# EAGLE design RingBoard (EAGLE 6.2)
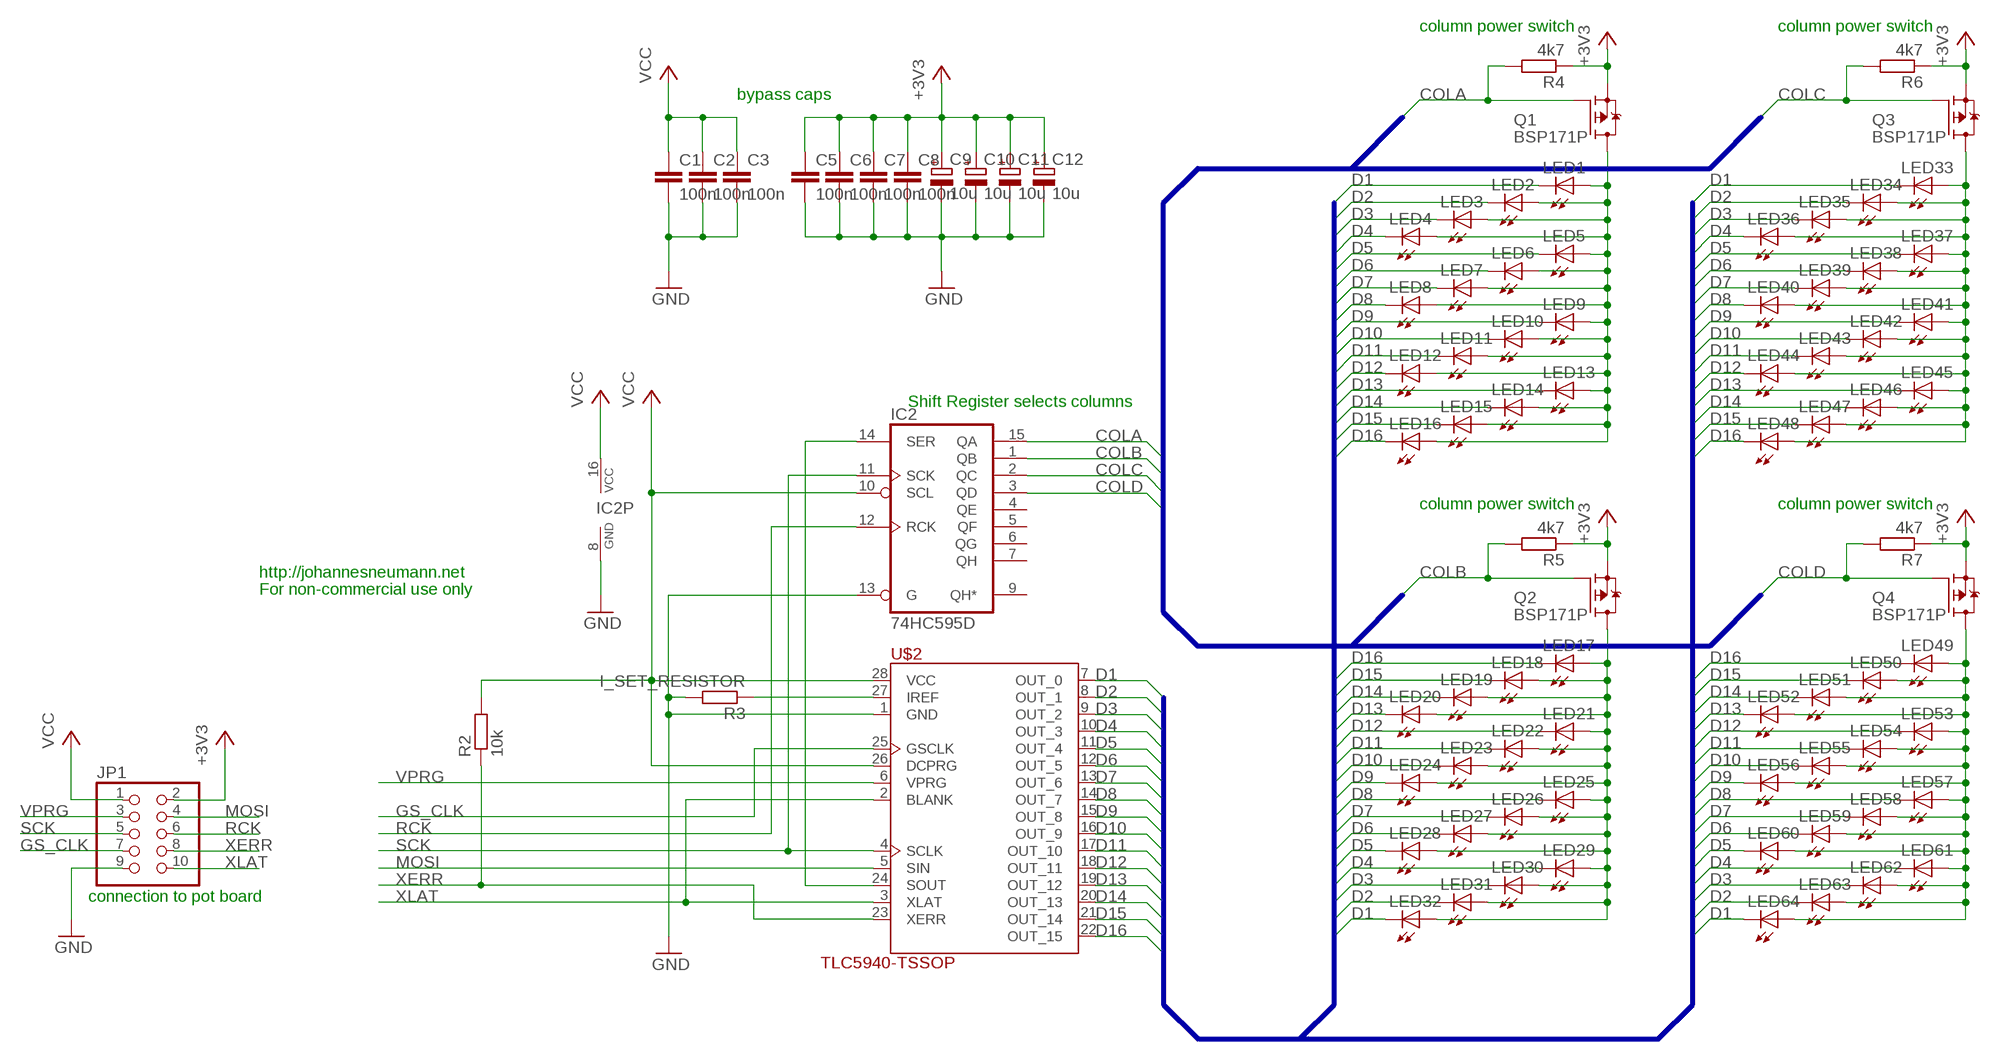
[diagram p0: schematic, sheet 1]

## Parts
C1  100n  C-EUC0603  [C0603]
C2  100n  C-EUC0603  [C0603]
C3  100n  C-EUC0603  [C0603]
C5  100n  C-EUC0603  [C0603]
C6  100n  C-EUC0603  [C0603]
C7  100n  C-EUC0603  [C0603]
C8  100n  C-EUC0603  [C0603]
C9  10u  CPOL-EU153CLV-0605  [153CLV-0605]
C10  10u  CPOL-EU153CLV-0605  [153CLV-0605]
C11  10u  CPOL-EU153CLV-0605  [153CLV-0605]
C12  10u  CPOL-EU153CLV-0605  [153CLV-0605]
IC2  74HC595D  [SO16]
JP1  PINHD-2X5_2.54-SMD  [2X05SMD]
LED1  LEDCHIP-LED0805  [CHIP-LED0805]
LED2  LEDCHIP-LED0805  [CHIP-LED0805]
LED3  LEDCHIP-LED0805  [CHIP-LED0805]
LED4  LEDCHIP-LED0805  [CHIP-LED0805]
LED5  LEDCHIP-LED0805  [CHIP-LED0805]
LED6  LEDCHIP-LED0805  [CHIP-LED0805]
LED7  LEDCHIP-LED0805  [CHIP-LED0805]
LED8  LEDCHIP-LED0805  [CHIP-LED0805]
LED9  LEDCHIP-LED0805  [CHIP-LED0805]
LED10  LEDCHIP-LED0805  [CHIP-LED0805]
LED11  LEDCHIP-LED0805  [CHIP-LED0805]
LED12  LEDCHIP-LED0805  [CHIP-LED0805]
LED13  LEDCHIP-LED0805  [CHIP-LED0805]
LED14  LEDCHIP-LED0805  [CHIP-LED0805]
LED15  LEDCHIP-LED0805  [CHIP-LED0805]
LED16  LEDCHIP-LED0805  [CHIP-LED0805]
LED17  LEDCHIP-LED0805  [CHIP-LED0805]
LED18  LEDCHIP-LED0805  [CHIP-LED0805]
LED19  LEDCHIP-LED0805  [CHIP-LED0805]
LED20  LEDCHIP-LED0805  [CHIP-LED0805]
LED21  LEDCHIP-LED0805  [CHIP-LED0805]
LED22  LEDCHIP-LED0805  [CHIP-LED0805]
LED23  LEDCHIP-LED0805  [CHIP-LED0805]
LED24  LEDCHIP-LED0805  [CHIP-LED0805]
LED25  LEDCHIP-LED0805  [CHIP-LED0805]
LED26  LEDCHIP-LED0805  [CHIP-LED0805]
LED27  LEDCHIP-LED0805  [CHIP-LED0805]
LED28  LEDCHIP-LED0805  [CHIP-LED0805]
LED29  LEDCHIP-LED0805  [CHIP-LED0805]
LED30  LEDCHIP-LED0805  [CHIP-LED0805]
LED31  LEDCHIP-LED0805  [CHIP-LED0805]
LED32  LEDCHIP-LED0805  [CHIP-LED0805]
LED33  LEDCHIP-LED0805  [CHIP-LED0805]
LED34  LEDCHIP-LED0805  [CHIP-LED0805]
LED35  LEDCHIP-LED0805  [CHIP-LED0805]
LED36  LEDCHIP-LED0805  [CHIP-LED0805]
LED37  LEDCHIP-LED0805  [CHIP-LED0805]
LED38  LEDCHIP-LED0805  [CHIP-LED0805]
LED39  LEDCHIP-LED0805  [CHIP-LED0805]
LED40  LEDCHIP-LED0805  [CHIP-LED0805]
LED41  LEDCHIP-LED0805  [CHIP-LED0805]
LED42  LEDCHIP-LED0805  [CHIP-LED0805]
LED43  LEDCHIP-LED0805  [CHIP-LED0805]
LED44  LEDCHIP-LED0805  [CHIP-LED0805]
LED45  LEDCHIP-LED0805  [CHIP-LED0805]
LED46  LEDCHIP-LED0805  [CHIP-LED0805]
LED47  LEDCHIP-LED0805  [CHIP-LED0805]
LED48  LEDCHIP-LED0805  [CHIP-LED0805]
LED49  LEDCHIP-LED0805  [CHIP-LED0805]
LED50  LEDCHIP-LED0805  [CHIP-LED0805]
LED51  LEDCHIP-LED0805  [CHIP-LED0805]
LED52  LEDCHIP-LED0805  [CHIP-LED0805]
LED53  LEDCHIP-LED0805  [CHIP-LED0805]
LED54  LEDCHIP-LED0805  [CHIP-LED0805]
LED55  LEDCHIP-LED0805  [CHIP-LED0805]
LED56  LEDCHIP-LED0805  [CHIP-LED0805]
LED57  LEDCHIP-LED0805  [CHIP-LED0805]
LED58  LEDCHIP-LED0805  [CHIP-LED0805]
LED59  LEDCHIP-LED0805  [CHIP-LED0805]
LED60  LEDCHIP-LED0805  [CHIP-LED0805]
LED61  LEDCHIP-LED0805  [CHIP-LED0805]
LED62  LEDCHIP-LED0805  [CHIP-LED0805]
LED63  LEDCHIP-LED0805  [CHIP-LED0805]
LED64  LEDCHIP-LED0805  [CHIP-LED0805]
Q1  BSP171P  BSP170P  [SOT223]
Q2  BSP171P  BSP170P  [SOT223]
Q3  BSP171P  BSP170P  [SOT223]
Q4  BSP171P  BSP170P  [SOT223]
R2  10k  R-EU_R0603  [R0603]
R3  I_SET_RESISTOR  R-EU_M1406  [M1406]
R4  4k7  R-EU_R0603  [R0603]
R5  4k7  R-EU_R0603  [R0603]
R6  4k7  R-EU_R0603  [R0603]
R7  4k7  R-EU_R0603  [R0603]
U$2  TLC5940-TSSOP  [HTSSOP-28]

## Nets
+3V3: C5.1 C6.1 C7.1 C8.1 C9.+ C10.+ C11.+ C12.+ JP1.2 Q1.3(S) Q2.3(S) Q3.3(S) Q4.3(S) R4.1 R5.1 R6.1 R7.1
COLA: IC2.15(QA) Q1.1(G) R4.2
COLB: IC2.1(QB) Q2.1(G) R5.2
COLC: IC2.2(QC) Q3.1(G) R6.2
COLD: IC2.3(QD) Q4.1(G) R7.2
D1: LED1.C LED32.C LED33.C LED64.C U$2.7(OUT_0)
D2: LED2.C LED31.C LED34.C LED63.C U$2.8(OUT_1)
D3: LED3.C LED30.C LED35.C LED62.C U$2.9(OUT_2)
D4: LED4.C LED29.C LED36.C LED61.C U$2.10(OUT_3)
D5: LED5.C LED28.C LED37.C LED60.C U$2.11(OUT_4)
D6: LED6.C LED27.C LED38.C LED59.C U$2.12(OUT_5)
D7: LED7.C LED26.C LED39.C LED58.C U$2.13(OUT_6)
D8: LED8.C LED25.C LED40.C LED57.C U$2.14(OUT_7)
D9: LED9.C LED24.C LED41.C LED56.C U$2.15(OUT_8)
D10: LED10.C LED23.C LED42.C LED55.C U$2.16(OUT_9)
D11: LED11.C LED22.C LED43.C LED54.C U$2.17(OUT_10)
D12: LED12.C LED21.C LED44.C LED53.C U$2.18(OUT_11)
D13: LED13.C LED20.C LED45.C LED52.C U$2.19(OUT_12)
D14: LED14.C LED19.C LED46.C LED51.C U$2.20(OUT_13)
D15: LED15.C LED18.C LED47.C LED50.C U$2.21(OUT_14)
D16: LED16.C LED17.C LED48.C LED49.C U$2.22(OUT_15)
GND: C1.2 C2.2 C3.2 C5.2 C6.2 C7.2 C8.2 C9.- C10.- C11.- C12.- IC2.8(GND) IC2.13(G) JP1.9 R3.2 U$2.1(GND)
GS_CLK: JP1.7 U$2.25(GSCLK)
MOSI: JP1.4 U$2.5(SIN)
N$2: IC2.14(SER) U$2.24(SOUT)
N$4: LED17.A LED18.A LED19.A LED20.A LED21.A LED22.A LED23.A LED24.A LED25.A LED26.A LED27.A LED28.A LED29.A LED30.A LED31.A LED32.A Q2.2(D) Q2.4(D)
N$6: LED33.A LED34.A LED35.A LED36.A LED37.A LED38.A LED39.A LED40.A LED41.A LED42.A LED43.A LED44.A LED45.A LED46.A LED47.A LED48.A Q3.2(D) Q3.4(D)
N$8: LED49.A LED50.A LED51.A LED52.A LED53.A LED54.A LED55.A LED56.A LED57.A LED58.A LED59.A LED60.A LED61.A LED62.A LED63.A LED64.A Q4.2(D) Q4.4(D)
N$29: LED1.A LED2.A LED3.A LED4.A LED5.A LED6.A LED7.A LED8.A LED9.A LED10.A LED11.A LED12.A LED13.A LED14.A LED15.A LED16.A Q1.2(D) Q1.4(D)
N$41: R3.1 U$2.27(IREF)
RCK: IC2.12(RCK) JP1.6
SCK: IC2.11(SCK) JP1.5 U$2.4(SCLK)
VCC: C1.1 C2.1 C3.1 IC2.10(SCL) IC2.16(VCC) JP1.1 R2.2 U$2.26(DCPRG) U$2.28(VCC)
VPRG: JP1.3 U$2.6(VPRG)
XERR: JP1.8 R2.1 U$2.23(XERR)
XLAT: JP1.10 U$2.2(BLANK) U$2.3(XLAT)
Unconnected: IC2.4(QE) IC2.5(QF) IC2.6(QG) IC2.7(QH) IC2.9(QH*)

## Buses
B$1
B$2

## Notes on the sheet
- column power switch | column power switch
- bypass caps
- Shift Register selects columns
- column power switch | column power switch
- http://johannesneumann.net
- For non-commercial use only
- connection to pot board

## Library data of the parts
C1-C3 C5-C8 = rcl:C-EU: CAPACITOR, European symbol
C9-C12 = rcl:CPOL-EU: POLARIZED CAPACITOR, European symbol
IC2 = 74xx-eu:74*595: 8-bit SHIFT REGISTER, output latch
JP1 = pinhead-2:PINHD-2X5: PIN HEADER
LED1-LED64 = led:LED: LED OSRAM: - CHIPLED LG R971, LG N971, LY N971, LG Q971, LY Q971, LO R971, LY R971 LH N974, LH R974 LS Q976, LO Q976, LY Q976 LO Q996 - Hyper CHIPLED LW Q18S LB Q993, LB Q99A, LB R99A - SideLED LS A670, LO A670, LY A670, LG A670, LP A670 LB A673, LV A673, LT A673, LW A673 LH A674 LY A675 LS A676, LA A676, LO A676, LY A676, LW A676 LS A679, LY A679, LG A679 - Hyper Micro SIDELED® LS Y876, LA Y876, LO Y876, LY Y876 LT Y87S - SmartLED LW L88C, LW L88S LB L89C, LB L89S, LG L890 LS L89K, LO L89K, LY L89K LS L896, LA L896, LO L896, LY L896 - TOPLED LS T670, LO T670, LY T670, LG T670, LP T670 LSG T670, LSP T670, LSY T670, LOP T670, LYG T670 LG T671, LOG T671, LSG T671 LB T673, LV T673, LT T673, LW T673 LH T674 LS T676, LA T676, LO T676, LY T676, LB T676, LH T676, LSB T676, LW T676 LB T67C, LV T67C, LT T67C, LS T67K, LO T67K, LY T67K, LW E67C LS E67B, LA E67B, LO E67B, LY E67B, LB E67C, LV E67C, LT E67C LW T67C LS T679, LY T679, LG T679 LS T770, LO T770, LY T770, LG T770, LP T770 LB T773, LV T773, LT T773, LW T773 LH T774 LS E675, LA E675, LY E675, LS T675 LS T776, LA T776, LO T776, LY T776, LB T776 LHGB T686 LT T68C, LB T68C - Hyper Mini TOPLED® LB M676 - Mini TOPLED Santana® LG M470 LS M47K, LO M47K, LY M47K Source: http://www.osram.convergy.de LUXEON: - LUMILED® LXK2-PW12-R00, LXK2-PW12-S00, LXK2-PW14-U00, LXK2-PW14-V00 LXK2-PM12-R00, LXK2-PM12-S00, LXK2-PM14-U00 LXK2-PE12-Q00, LXK2-PE12-R00, LXK2-PE12-S00, LXK2-PE14-T00, LXK2-PE14-U00 LXK2-PB12-K00, LXK2-PB12-L00, LXK2-PB12-M00, LXK2-PB14-N00, LXK2-PB14-P00, LXK2-PB14-Q00 LXK2-PR12-L00, LXK2-PR12-M00, LXK2-PR14-Q00, LXK2-PR14-R00 LXK2-PD12-Q00, LXK2-PD12-R00, LXK2-PD12-S00 LXK2-PH12-R00, LXK2-PH12-S00 LXK2-PL12-P00, LXK2-PL12-Q00, LXK2-PL12-R00 Source: www.luxeon.com KINGBRIGHT: KA-3528ASYC Source: www.kingbright.com
Q1-Q4 = transistor-fet:BSP170P: SIPMOS(R) Small-Signal-Transistor P-Channel, Enhancement mode Source: http://www.infineon.com/upload/Document/BSP170P_Rev2.4.pdf
R2-R7 = rcl:R-EU_: RESISTOR, European symbol
U$2 = tlc5940:TLC5940-TSSOP

## Board
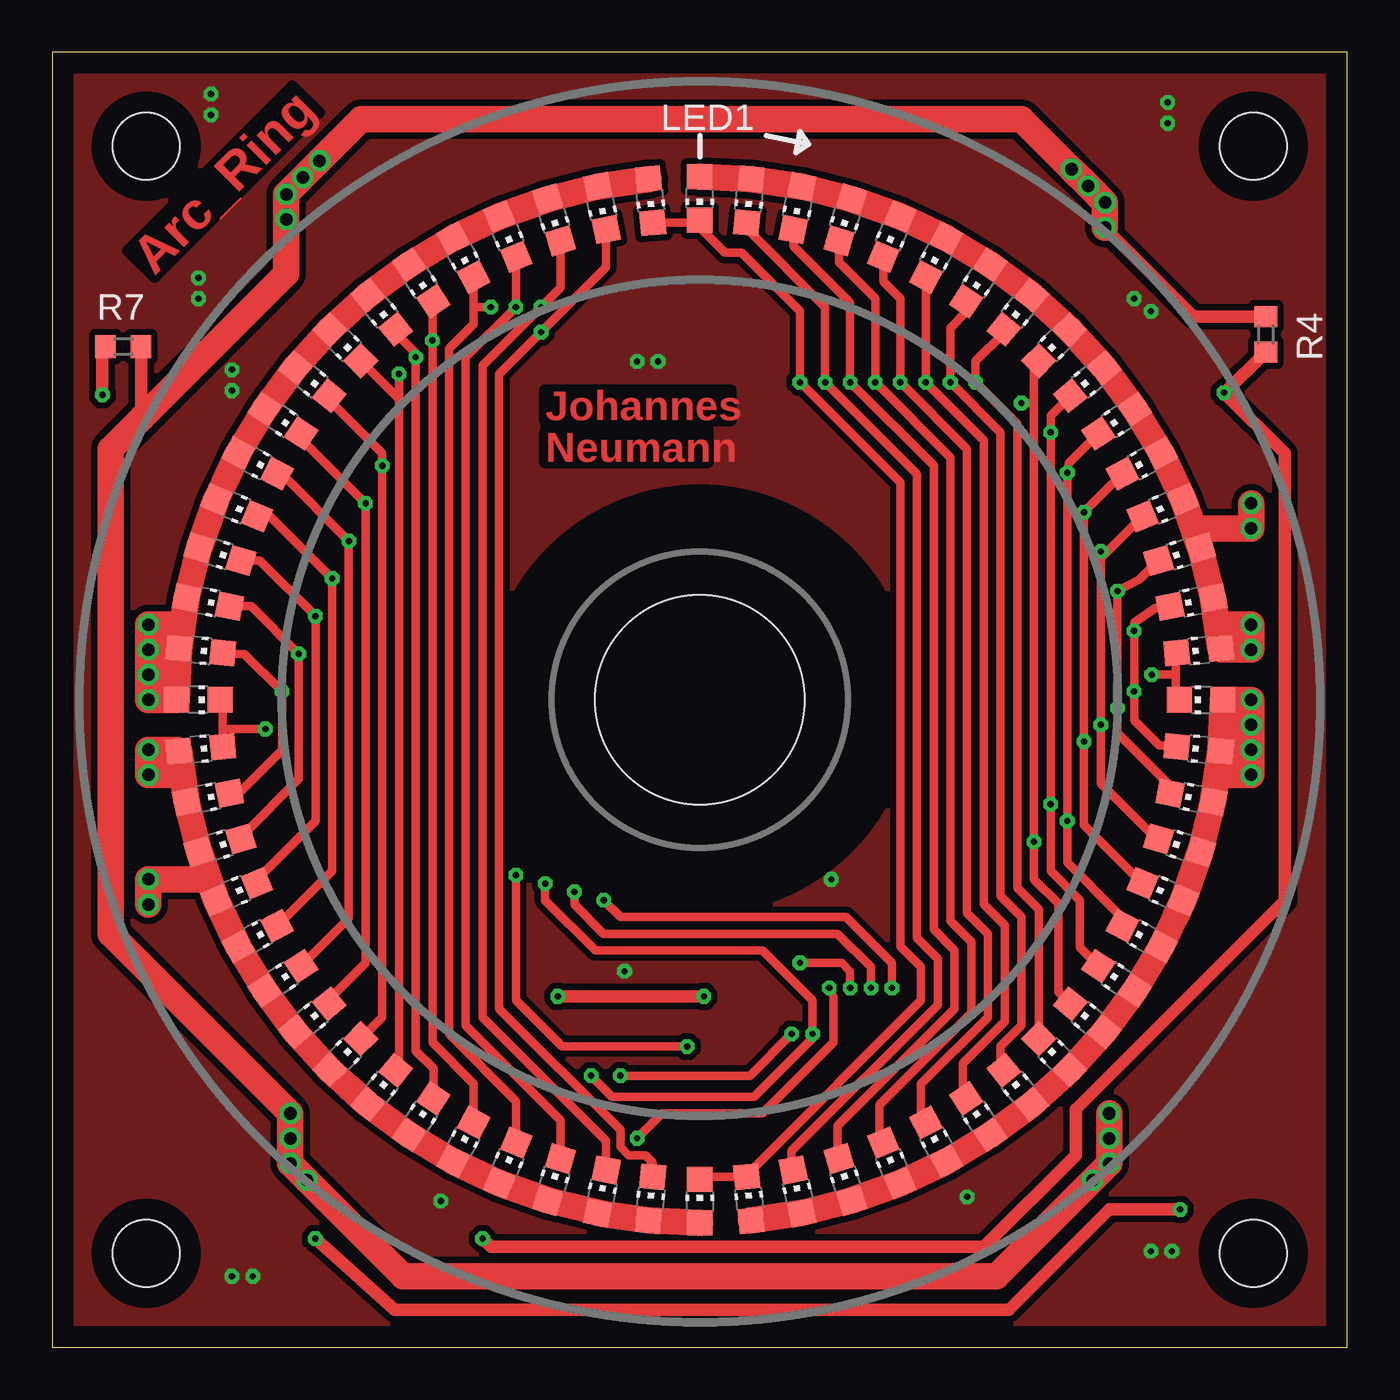
[diagram p1: board, top side]
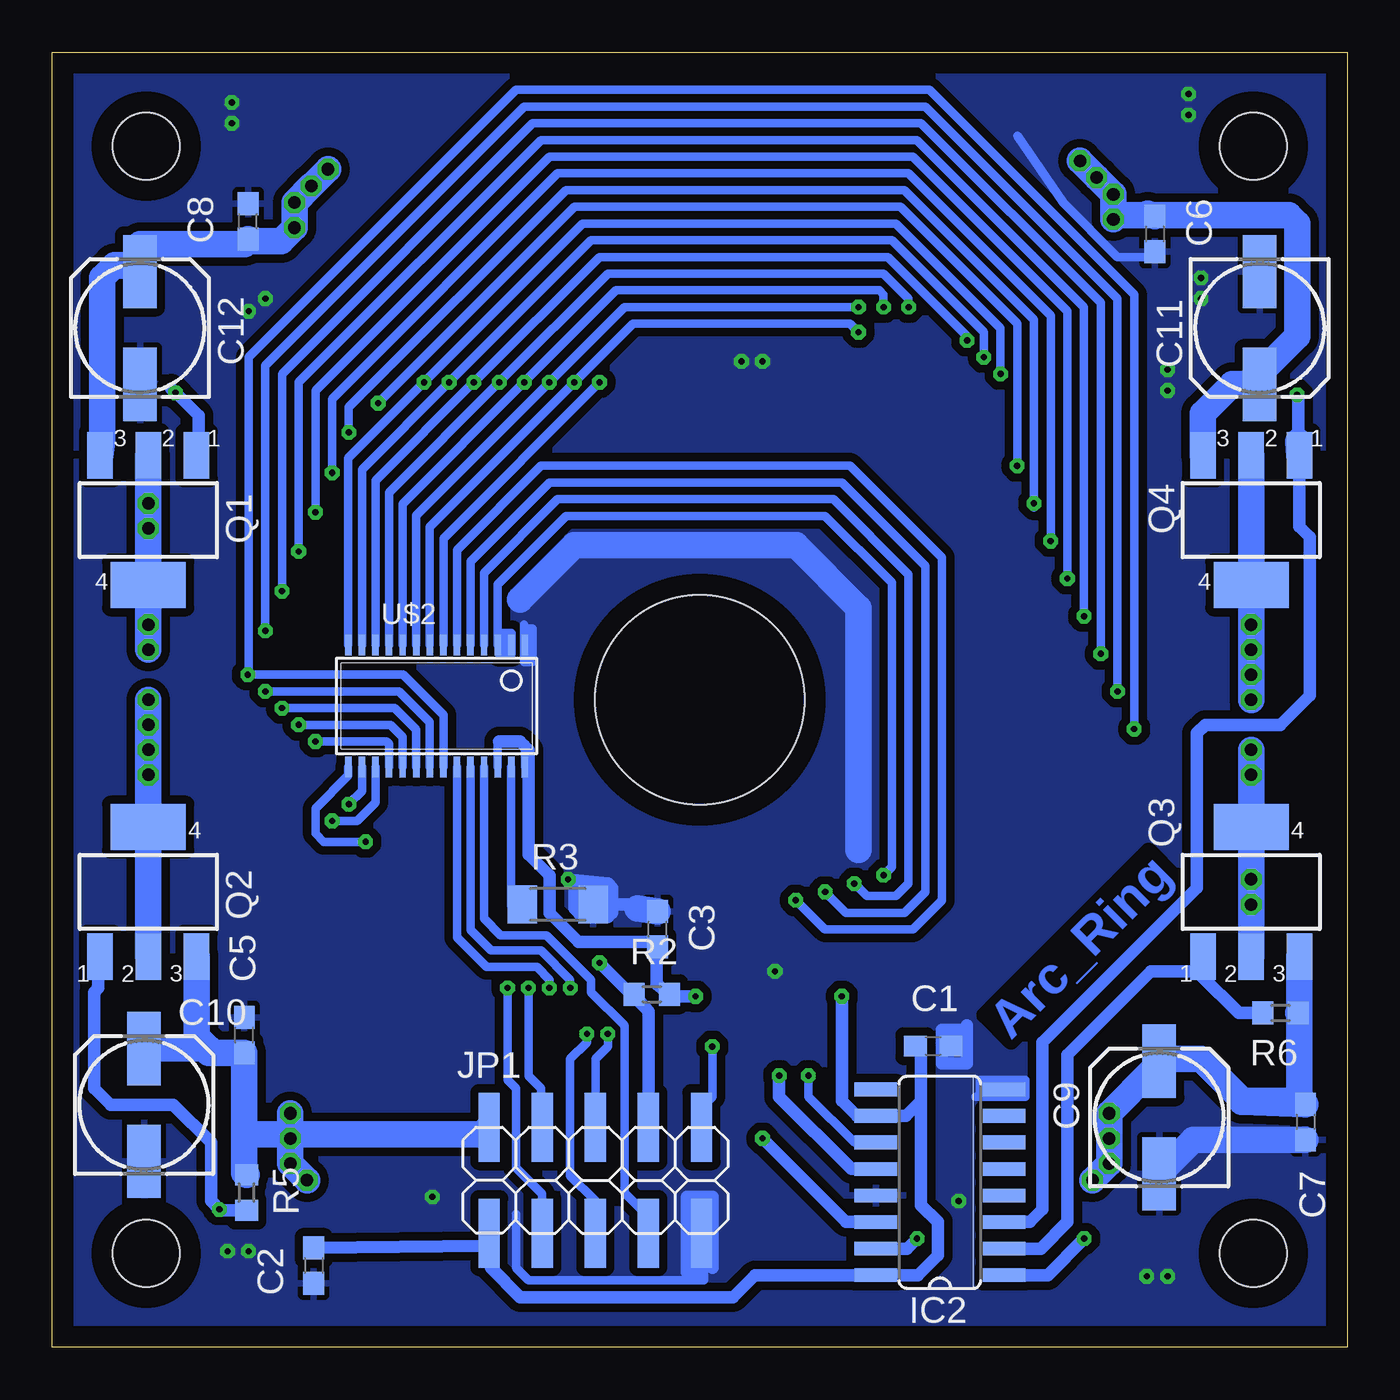
[diagram p2: board, bottom side, seen from below]

Size 62 x 62 mm. Coordinates in mm from the lower left corner, seen from the top.
Outline: 0,0 62,0 62,62 0,62 0,0
Copper layers (1*16): Top 0.035mm / dielectric 1.5mm / Bottom 0.035mm
Design rules "default": minimum track width 0.2mm, minimum drill 0.3mm, track to track 0.2mm, track to pad 0.2mm, pad to pad 0.2mm, via to via 0.2mm, smd to smd 0.15mm, copper to edge 40mil, drill to drill 8mil, minimum pad ring 0.2mm, minimum via ring 0.2mm, stop-mask expansion 0.15mm, vias tented up to drill 0.6mm, thermal gap 10mil
Holes 3.2 mm at 4.5,4.5 57.5,57.5 4.5,57.5 57.5,4.5
Holes 10 mm at 31,31
bKeepout: area 23.4,22.4 to 38.4,37.4
tRestrict: area 26,26 to 36,36

### Footprints (pad centres in the part's own frame; a part is rotated, then mirrored left to right if it is on the bottom)
C0603 = smd 1.1 x 1: 1 -0.85,0; 2 0.85,0
153CLV-0605 = smd 3.5 x 1.6: + 2.7,0; - -2.7,0
SO16 = smd 0.66 x 2.032: 1 -4.445,-3.073; 2 -3.175,-3.073; 3 -1.905,-3.073; 4 -0.635,-3.073; 5 0.635,-3.073; 6 1.905,-3.073; 7 3.175,-3.073; 8 4.445,-3.073; 9 4.445,3.073; 10 3.175,3.073; 11 1.905,3.073; 12 0.635,3.073; 13 -0.635,3.073; 14 -1.905,3.073; 15 -3.175,3.073; 16 -4.445,3.073
2X05SMD = smd 1.016 x 3.302: 1 -5.08,-2.54; 2 -5.08,2.54; 3 -2.54,-2.54; 4 -2.54,2.54; 5 0,-2.54; 6 0,2.54; 7 2.54,-2.54; 8 2.54,2.54; 9 5.08,-2.54; 10 5.08,2.54
CHIP-LED0805 = smd 1.2 x 1.2: A 0,-1.05; C 0,1.05
SOT223 = smd 1.219 x 2.235: 1 -2.311,-3.099; 2 0,-3.099; 3 2.311,-3.099 | smd 3.6 x 2.2: 4 0,3.099
R0603 = smd 1 x 1.1: 1 -0.85,0; 2 0.85,0
M1406 = smd 1.4 x 1.8: 1 -1.7,0; 2 1.7,0
HTSSOP-28 = smd 0.305 x 0.991: 1 -4.225,-2.918; 2 -3.575,-2.918; 3 -2.925,-2.918; 4 -2.275,-2.918; 5 -1.625,-2.918; 6 -0.975,-2.918; 7 -0.325,-2.918; 8 0.325,-2.918; 9 0.975,-2.918; 10 1.625,-2.918; 11 2.275,-2.918; 12 2.925,-2.918; 13 3.575,-2.918; 14 4.225,-2.918; 15 4.225,2.918; 16 3.575,2.918; 17 2.925,2.918; 18 2.275,2.918; 19 1.625,2.918; 20 0.975,2.918; 21 0.325,2.918; 22 -0.325,2.918; 23 -0.975,2.918; 24 -1.625,2.918; 25 -2.275,2.918; 26 -2.925,2.918; 27 -3.575,2.918; 28 -4.225,2.918

### Placement (x,y rotation side)
C1  19.83,14.42 0 bottom
C2  49.48,3.91 270 bottom
C3  33.02,20.01 90 bottom
C5  52.8,14.95 90 bottom
C6  9.22,53.31 270 bottom
C7  2,10.79 270 bottom
C8  52.62,53.91 90 bottom
C9  9,11 90 bottom
C10  57.6,11.6 90 bottom
C11  4.2,48.8 270 bottom
C12  57.8,48.8 90 bottom
IC2  19.5,7.9 90 bottom
JP1  36,8 0 bottom
LED1  31,55 180 top
LED2  33.35,54.88 174.4 top
LED3  35.68,54.54 168.8 top
LED4  37.97,53.97 163.1 top
LED5  40.18,53.17 157.5 top
LED6  42.31,52.17 151.9 top
LED7  44.33,50.96 146.2 top
LED8  46.23,49.55 140.6 top
LED9  47.97,47.97 135 top
LED10  49.55,46.23 129.4 top
LED11  50.96,44.33 123.8 top
LED12  52.17,42.31 118.1 top
LED13  53.17,40.18 112.5 top
LED14  53.97,37.97 106.9 top
LED15  54.54,35.68 101.2 top
LED16  54.88,33.35 95.6 top
LED17  55,31 90 top
LED18  54.88,28.65 84.4 top
LED19  54.54,26.32 78.8 top
LED20  53.97,24.03 73.1 top
LED21  53.17,21.82 67.5 top
LED22  52.17,19.69 61.9 top
LED23  50.96,17.67 56.2 top
LED24  49.55,15.77 50.6 top
LED25  47.97,14.03 45 top
LED26  46.23,12.45 39.4 top
LED27  44.33,11.04 33.8 top
LED28  42.31,9.83 28.1 top
LED29  40.18,8.83 22.5 top
LED30  37.97,8.03 16.9 top
LED31  35.68,7.46 11.2 top
LED32  33.35,7.12 5.6 top
LED33  31,7 0 top
LED34  28.65,7.12 354.4 top
LED35  26.32,7.46 348.8 top
LED36  24.03,8.03 343.1 top
LED37  21.82,8.83 337.5 top
LED38  19.69,9.83 331.9 top
LED39  17.67,11.04 326.2 top
LED40  15.77,12.45 320.6 top
LED41  14.03,14.03 315 top
LED42  12.45,15.77 309.4 top
LED43  11.04,17.67 303.8 top
LED44  9.83,19.69 298.1 top
LED45  8.83,21.82 292.5 top
LED46  8.03,24.03 286.9 top
LED47  7.46,26.32 281.2 top
LED48  7.12,28.65 275.6 top
LED49  7,31 270 top
LED50  7.12,33.35 264.4 top
LED51  7.46,35.68 258.8 top
LED52  8.03,37.97 253.1 top
LED53  8.83,40.18 247.5 top
LED54  9.83,42.31 241.9 top
LED55  11.04,44.33 236.2 top
LED56  12.45,46.23 230.6 top
LED57  14.03,47.97 225 top
LED58  15.77,49.55 219.4 top
LED59  17.67,50.96 213.8 top
LED60  19.69,52.17 208.1 top
LED61  21.82,53.17 202.5 top
LED62  24.03,53.97 196.9 top
LED63  26.32,54.54 191.2 top
LED64  28.65,54.88 185.6 top
Q1  57.4,39.6 180 bottom
Q2  57.4,21.8 0 bottom
Q3  4.6,21.8 0 bottom
Q4  4.6,39.6 180 bottom
R2  33.3,16.9 0 bottom
R3  37.8,21.2 0 bottom
R4  58.1,48.5 270 top
R5  52.7,7.4 270 bottom
R6  3.2,16 180 bottom
R7  3.4,47.9 180 top
U$2  43.6,30.7 180 bottom

### Tracks (layer width: path | path; a pad name or v marks a point on that pad's centre or on a via)
+3V3  (via drill 0.6)
  Top 0.61: R4.1 54.65,49.35 v50.4,53.6 | R7.1 4.25,44.55 4.3,44.5
  Top 1.27: v50.6,11.2 v50.6,8.8 45.2,3.4 16.8,3.4 v12.2,8 v11.4,8.8 v11.4,11.2 2.8,19.8 2.8,43 4.3,44.5 11.2,51.4 v11.2,55.2 v12.8,56.8 14.8,58.8 46.4,58.8 v48.8,56.4 v49.6,55.6 v50.4,54.8 v50.4,53.6
  Bottom 0.406: C9.+ 9,13.6 9.3,13.3
  Bottom 0.813: JP1.2 41.08,10.28 | 41.08,10.28 41,10.2 | 41.08,10.28 41.2,10.4
  Bottom 1.27: 5.04,11.74 C7.1 2.29,12.03 Q3.3 | Q3.3 2.29,16.06 R6.1 | v50.4,54.8 v50.4,53.6 51.04,52.96 52.52,52.96 C8.1 | v11.2,55.2 11.2,55 | v50.4,54.8 v49.6,55.6 | v50.6,11.2 v50.6,10 | v50.6,10 v50.6,8.8 v49.8,8 | Q3.3 2.29,11.89 2.2,11.8 5,11.8 7,13.8 8.8,13.8 9.3,13.3 v11.4,11.2 v11.4,10 v11.4,8.8 v12.2,8 | v12,56 v12.8,56.8 v11.2,55.2 | v50.4,54.8 v48.8,56.4 | 52.7,52.88 C8.1 | C12.+ 57.9,51.7 59,51.8 | Q1.3 59.6,43.41 59.6,51.2 59,51.8 | 59,51.8 57.8,51.8 57.8,52.8 52.78,52.8 C8.1 | Q4.3 6.91,44.69 5.5,46.1 C11.+ 4.1,46.7 2.4,48.4 2.4,53.8 2.8,54.2 9.8,54.2 | v11.2,55.2 11.2,54.2 9.8,54.2 | C6.1 9.54,54.26 9.8,54.2 | v11.2,54 v11.2,55.2 | Q2.3 55.09,15.8 | 55.09,15.8 55.09,14.89 54.5,14.3 | 55.19,15.9 55.09,15.8 | 52.8,10.2 C5.1 54.5,14.1 54.5,14.3 | 52.8,10.2 50.8,10.2 | 50.8,10.2 v50.6,10 | C10.+ 54.5,14.3 | 52.8,10.2 52.8,8.35 R5.1 | 41.2,10.4 41.4,10.2 50.8,10.2
COLA  (via drill 0.3)
  Top 0.61: R4.2 56.1,45.65 v56.1,45.7 59,42.8 59,21.4 49,11.4 49,9.2 44.6,4.8 21,4.8 v20.6,5.2
  Bottom 0.61: Q1.1 55,43.39 55,44.6 v56.1,45.7 56.3,45.9 | v20.6,5.2 21.07,4.72 IC2.15
COLB  (via drill 0.3)
  Top 0.61: v12.6,5.2 16.4,1.8 45.8,1.8 50.6,6.6 v54,6.6
  Bottom 0.61: v12.6,5.2 14.35,3.46 IC2.1 | R5.2 53.95,6.55 v54,6.6 54.4,7 54.4,9.8 56.2,11.6 59.2,11.6 60,12.4 60,17 59.8,17.2 59.8,18.79 Q2.1
COLC
  Bottom 0.61: R6.2 5.2,16 7,17.8 7,18 | 7,18 7,18.61 Q3.1 | IC2.2 14.68,4.72 13.4,6 13.4,14 9.4,18 7,18
COLD  (via drill 0.3)
  Top 0.61: v2.4,45.6 2.4,47.75 R7.2
  Bottom 0.61: Q4.1 2.29,39.29 1.8,38.8 1.8,31.2 3.2,29.8 6.8,29.8 7.2,29.4 7.2,22 14.6,14.6 14.6,6.6 15.2,6 IC2.3 | 2.35,43.36 2.35,45.55 v2.4,45.6
  Bottom 1.27: 2.35,43.36 Q4.1
D1  (via drill 0.3)
  Top 0.406: LED33.C 31.11,8.16 LED32.C 33.6,8.51 33.6,8.6 41.6,16.6 41.6,18.2 40.6,19.2 40.6,41.4 v35.8,46.2 35.8,49.6 33,52.4 32.2,52.4 31,53.6 LED1.C 30.89,53.84 LED64.C
  Bottom 0.406: U$2.7 43.27,38.73 v35.8,46.2
D2  (via drill 0.3)
  Top 0.406: LED2.C 33.25,53.55 37,49.8 v37,46.2 41.4,41.8 41.4,19.6 42.4,18.6 42.4,16.4 35.4,9.4 35.4,8.57 LED31.C | LED63.C 26.52,51.72 v23.4,48.6 21.4,46.6 21.4,16.2 27.2,10.4 27.2,9.6 27.6,9.2 28.4,9.2 28.75,8.85 LED34.C | LED34.C
  Bottom 0.406: U$2.8 43.92,39.27 v37,46.2 34.2,49 23.8,49 v23.4,48.6
D3  (via drill 0.3)
  Top 0.406: LED3.C 35.48,52.72 38.2,50 v38.2,46.2 42.2,42.2 42.2,20 43.2,19 43.2,16.2 37.6,10.6 37.6,9.1 LED30.C | 26.52,8.69 26.52,9.88 20.6,15.8 20.6,47 v23.4,49.8 | LED62.C 24.34,50.74 v23.4,49.8 | v23.4,49.8 23.5,49.7
  Top 0.61: LED35.C 26.52,8.69 | 26.52,8.69
  Bottom 0.406: U$2.9 44.58,39.83 v38.2,46.2 34.6,49.8 v23.4,49.8
D4  (via drill 0.3)
  Top 0.406: LED4.C 37.66,51.94 39.4,50.2 v39.4,46.2 43,42.6 43,20.4 44,19.4 44,16 39.6,11.6 39.6,9.98 LED29.C | 24.34,9.24 24.34,10.86 19.8,15.4 19.8,47.4 v22.2,49.8 22.22,50.22 22.22,51.22 | LED61.C 22.22,51.22 | 22.22,51.22 22.2,51.2 22.2,52.4
  Top 0.61: LED36.C 24.34,9.24 | 24.34,9.24
  Bottom 0.406: U$2.10 45.23,40.38 v39.4,46.2 35,50.6 22.4,50.6 22.2,50.4 v22.2,49.8
D5  (via drill 0.3)
  Top 0.406: LED5.C 39.78,51.02 40.6,50.2 v40.6,46.2 43.8,43 43.8,20.8 44.8,19.8 44.8,15.8 41.6,12.6 41.6,10.98 LED28.C | 22.22,10 22.22,11.78 19,15 19,47.8 20.18,48.98 LED60.C 20.18,50.22 20.2,49.8 v21,49.8
  Top 0.61: LED37.C 22.22,10 | 22.22,10
  Bottom 0.406: U$2.11 45.88,40.92 v40.6,46.2 35.4,51.4 22.2,51.4 21,50.2 v21,49.8
D6  (via drill 0.3)
  Top 0.406: LED6.C v41.82,46.2 42.02,45.98 44.6,43.4 | 20.18,10.96 20.18,12.62 18.2,14.6 v18.2,48.2 18.2,49.6 18.25,49.65 LED59.C | LED27.C 43.6,12.07 43.6,13.6 45.6,15.6 45.6,20.2 44.6,21.2 44.6,43.4 | 44.6,43.4 44.61,43.41
  Top 0.61: LED38.C 20.18,10.96 | 20.18,10.96
  Bottom 0.406: U$2.12 46.52,41.49 v41.82,46.2 41.8,46.2 35.8,52.2 22,52.2 18.2,48.4 v18.2,48.2
D7  (via drill 0.3)
  Top 0.406: 18.25,12.12 18.25,13.35 17.4,14.2 v17.4,47.4 17.4,47.6 16.44,48.56 LED58.C | LED7.C 43.75,49.55 43,48.8 v43,46.2 45.4,43.8 45.4,21.6 46.4,20.6 46.4,15.4 45.4,14.4 45.4,13.42 LED26.C
  Top 0.61: LED39.C 18.25,12.12 | 18.25,12.12
  Bottom 0.406: U$2.13 47.17,42.02 v43,46.2 36.2,53 21.8,53 17.4,48.6 v17.4,47.4
D8  (via drill 0.3)
  Top 0.406: LED25.C 47.23,20.97 46.2,22 46.2,44.2 v44.2,46.2 44.2,47.2 45.56,48.56 LED8.C | 16.44,13.46 16.44,13.24 16.6,13.4 16.6,45.4 | 16.6,45.4 v16.6,46.6 | LED57.C | LED57.C 16.6,45.4
  Top 0.61: LED40.C 16.44,13.46 | 16.44,13.46
  Bottom 0.406: U$2.14 47.83,42.58 v44.2,46.2 36.6,53.8 21.6,53.8 16.6,48.8 v16.6,46.6
D9  (via drill 0.3)
  Top 0.406: 47,45.2 v47,24.2 47,22.4 48.16,21.24 48.16,17.02 LED24.C | 47,45.2 47,47 LED9.C | LED41.C 15.8,15.8 v15.8,42.2 15.8,42.8 13.26,45.34 LED56.C | v46.4,45.2 47,45.2
  Top 0.61: 14.77,14.97 LED41.C | LED41.C
  Bottom 0.406: U$2.15 47.83,27.38 49.4,25.8 49.4,24.6 49,24.2 v47,24.2 | v15.8,42.2 15.8,49 21.4,54.6 37,54.6 v46.4,45.2
D10  (via drill 0.3)
  Top 0.406: LED10.C 49.2,45.5 48.7,45.5 47.8,44.6 v47.8,43.8 v47.8,26 47.8,22.8 49.2,21.4 49.2,19.13 LED23.C | 13.26,16.64 13.84,17.22 13.84,17.24 15,18.4 v15,40.4 11.92,43.48 LED55.C
  Top 0.61: LED42.C 13.26,16.64 | 13.26,16.64
  Bottom 0.406: U$2.16 47.17,26.62 v47.8,26 | v47.8,43.8 47.8,45 37.4,55.4 21.2,55.4 15,49.2 v15,40.4 15,40.2
D11  (via drill 0.3)
  Top 0.406: LED22.C 51.02,20.78 48.6,23.2 v48.6,25.2 v48.6,41.87 48.67,42.33 LED11.C | 11.8,18.33 11.92,18.45 | LED54.C 10.98,41.82 v14.2,38.6 14.2,20.53 LED43.C
  Top 0.61: LED43.C 11.92,18.45 | 11.92,18.45
  Bottom 0.406: U$2.17 46.52,26.07 47.4,25.2 v48.6,25.2 | v14.2,38.6 14.2,49.4 21,56.2 37.8,56.2 48.6,45.4 v48.6,41.87
D12  (via drill 0.3)
  Top 0.406: LED21.C 51.98,22.22 51.98,22.42 49.4,25 v49.4,29 v49.4,39.98 LED12.C | 10.76,20.38 10.98,20.38 13.4,22.8 v13.4,36.8 10.42,39.78 LED53.C
  Top 0.61: LED44.C 10.78,20.18 10.98,20.38
  Bottom 0.406: U$2.18 45.88,28.88 46,29 v49.4,29 | v13.4,36.8 13.4,49.6 20.8,57 38.2,57 49.4,45.8 v49.4,39.98
D13  (via drill 0.3)
  Top 0.406: LED20.C 52.86,24.34 50.2,27 v50.2,29.8 50.2,37.78 | 9.8,22.42 10.02,22.42 10.02,22.62 12.6,25.2 v12.6,35 9.94,37.66 LED52.C | v50.2,38.1 50.2,37.78 | 50.2,37.78 LED13.C
  Top 0.61: 9.8,22.42 LED45.C | LED45.C
  Bottom 0.406: U$2.19 45.23,29.23 45.8,29.8 v50.2,29.8 | v12.6,35 12.6,49.8 20.6,57.8 38.6,57.8 50.2,46.2 v50.2,38.1
D14  (via drill 0.3)
  Top 0.406: LED19.C 53.51,26.89 51,29.4 v51,30.6 v51,36.2 52.05,36.75 LED14.C | 9.04,24.54 9.14,24.54 11.8,27.2 v11.8,33.2 9.52,35.48 LED51.C
  Top 0.61: LED46.C 9.04,24.54 | 9.04,24.54
  Bottom 0.406: U$2.20 44.58,29.57 45.6,30.6 v51,30.6 | v11.8,33.2 11.8,50 20.4,58.6 39,58.6 51,46.6 v51,36.2
D15  (via drill 0.3)
  Top 0.406: 53.83,35.8 LED15.C 53.43,35.4 52.8,35.4 51.8,34.7 v51.8,34.3 v51.8,31.4 51.8,30 53,28.8 53.79,28.8 LED18.C | LED47.C 8.92,26.52 11,28.6 v11,31.4 9.2,33.2 8.21,33.2 LED50.C
  Bottom 0.406: U$2.21 43.92,29.93 45.4,31.4 v51.8,31.4 | v11,31.4 11,50.2 20.2,59.4 39.4,59.4 51.8,47 v51.8,34.3
D16  (via drill 0.3)
  Top 0.406: 53.84,31.11 LED17.C 53.8,31.15 53.8,32.2 | 53.84,32.8 LED16.C 53.8,33.21 53.8,32.2 | v52.64,32.2 53.8,32.2 | LED48.C 8.16,29.64 | LED49.C 8.16,30.89 8.16,29.64 | 8.16,29.64 8.2,29.6 v10.2,29.6
  Bottom 0.406: U$2.22 43.27,30.27 45.2,32.2 v52.64,32.2 52.6,32.24 52.6,47.4 39.8,60.2 20,60.2 10.2,50.4 v10.2,29.6
GND  (via drill 0.3)
  Bottom 0.406: 39.4,33.6 U$2.1 39.2,33.62 | C6.2 9.38,52.2 11,52.2 13.6,54.8 15.8,58 | 15.4,12 17.6,12 | 17.8,12 17.6,12 | 17.6,12 17.6,12.8 15.4,12.8 15.4,12 | IC2.8 15.74,12.35 15.4,12 | 30.8,5.4 30.8,5.2 | 39.8,6.4 39.8,3.8 39.2,3.2 30.8,3.2 30.8,3.8 | 30.8,3.8 30.8,5.2 | 30.8,5.2 31,5.4 | 31.2,3.6 31.4,3.8 30.8,3.8 | 39.4,34.6 39.4,32.8 39.2,32.8 | 39.2,32.8 39,32.8 39,34.4 39.2,34.4 39.2,34.2 39.2,33.62 | 39.2,33.62 39.2,32.8
  Bottom 0.61: C3.2 34.06,21.2 R3.2 36.7,21.8 37,21.8 37,21 36.6,20.6 35.4,20.6 35.2,20.8 35.2,22 35.4,22.2 v37.3,22.4 | 18.2,15.4 18.2,15.2 | 18.2,15.2 18.2,13.6 19.4,13.6 19.4,15.2 19,15.2 | 19,15.2 18.2,15.2 | C1.2 18.88,15.08 19,15.2 | 30.4,3.8 30.4,7.2 31.6,7.2 31.6,3.6 31.2,3.6
  Bottom 1.27: C9.- 7.36,9.94 C7.2 | 39.6,35.8 37,38.4 26.4,38.4 23.4,35.4 23.4,23.8 | 33.98,21 C3.2
  other vias: 8.6,3.4 18.6,7 7.6,60 7.6,59 53.4,59.6 53.4,58.6 43.8,7.2 52.6,4.6 53.6,4.6 8.6,46.8 8.6,45.8 51.8,50.2 52.6,49.6 9.6,3.4 7,51.2 7,50.2 28,47.2 29,47.2 27.4,18
  pour Bottom (isolate 0.406): 0,62 62,62 62,0 0,0
  pour Top (isolate 0.305): 0.2,61.8 62,61.8 62,0 0.2,0
GS_CLK
  Bottom 0.406: U$2.25 41.33,20.52 40.52,19.73 38.33,19.73 36.2,17.6 36.2,17 34.6,15.4 34.6,7.4 33.6,6.4 33.6,5.6 JP1.7
MOSI  (via drill 0.3)
  Top 0.406: v39.2,17.2 39.2,18.2 37.6,19.8 26.4,19.8 25,21.2 v25,21.8
  Bottom 0.406: U$2.5 41.98,37.62 38.2,41.4 24.2,41.4 20.2,37.4 20.2,21.8 21.2,20.8 24,20.8 v25,21.8 | v39.2,17.2 39.2,13 38.6,12.4 38.6,10.6 JP1.4
N$2  (via drill 0.3)
  Top 0.406: v28,10 29.2,11.2 34,11.2 37.4,14.6 37.4,16.8 v37.2,17.2
  Bottom 0.406: U$2.24 41.98,19.98 41,19 38.6,19 37.2,17.6 v37.2,17.2
  Bottom 0.61: v28,10 24,6 IC2.14
N$3
  Bottom 0.406: 40.4,34.2 40.6,34.2 40.6,33.2 40,33.2 40,34.2 40.2,34.2 | 40.2,34.2 40.4,34.2 | 40.4,34.2 40.4,33.4 40.2,33.4 40.2,34.2
N$4  (via drill 0.6)
  Top 1.27: LED32.A LED31.A LED30.A LED29.A LED28.A LED27.A LED26.A LED25.A LED24.A LED23.A LED22.A 53.76,20.61 LED21.A LED20.A LED19.A LED18.A LED17.A v57.4,31 v57.4,27.4 55.8,27.4 | v57.4,28.6 56,28.6 | v57.4,29.8 56,29.8
  Bottom 1.27: Q2.2 Q2.4 57.2,25 57.4,25.2 v57.4,27.4 v57.4,28.6 v57.4,29.8 v57.4,31
N$6  (via drill 0.6)
  Top 1.27: LED35.A 26.64,6.35 | 26.64,6.35 LED34.A LED33.A | 26.64,6.35 LED36.A LED37.A LED38.A LED39.A LED40.A 14.22,12.44 LED41.A LED42.A LED43.A LED44.A LED45.A LED46.A LED47.A LED48.A 6.02,28.6 v4.6,28.6 v4.6,27.4 6,27.4 | v4.6,21.2 v4.6,22.4 7.4,22.4
  Bottom 1.27: Q3.2 v4.6,21.2 v4.6,22.4 Q3.4 v4.6,27.4 v4.6,28.6
N$8  (via drill 0.6)
  Top 1.27: 9.19,43.28 LED54.A 8.23,41.38 LED53.A LED52.A LED51.A LED50.A LED49.A v4.6,31 v4.6,32.2 | 9.19,43.28 LED55.A LED56.A LED57.A LED58.A LED59.A LED60.A LED61.A LED62.A LED63.A LED64.A | 9.18,43.3 9.19,43.28 | v4.6,34.6 v4.6,33.4 | v4.6,33.4 v4.6,32.2 | v4.6,32.2 5.8,32.2 | 6,32.2 5.8,32.2 | 5.8,32.2 v4.6,33.4 | v4.6,33.4 5.8,33.4 | 6,33.4 5.8,33.4 | 5.8,33.4 v4.6,34.6 | v4.6,34.6 6.2,34.6
  Bottom 1.27: Q4.4 Q4.2 v4.6,34.6 v4.6,33.4 v4.6,32.2 v4.6,31
N$29  (via drill 0.6)
  Top 1.27: LED1.A LED2.A LED3.A LED4.A LED5.A LED6.A LED7.A LED8.A LED9.A 49.27,48.1 LED10.A LED11.A LED12.A LED13.A LED14.A LED15.A LED16.A 55.98,33.4 v57.4,33.4 v57.4,34.6 55.8,34.6 | v57.4,40.4 v57.4,39.2 54.8,39.2
  Bottom 1.27: Q1.2 v57.4,40.4 v57.4,39.2 Q1.4 v57.4,34.6 v57.4,33.4
N$41
  Bottom 0.406: U$2.27 40.02,21.12 R3.1
RCK  (via drill 0.3)
  Top 0.406: v27.2,13 33.4,13 v35.4,15
  Bottom 0.406: IC2.12 23.54,8.54 | JP1.6 36,13.8 35.4,14.4 v35.4,15
  Bottom 0.61: 23.54,8.54 23.73,8.54 27.2,12 v27.2,13
SCK  (via drill 0.3)
  Top 0.406: v23.6,22.2 23.6,21.4 26,19 34,19 36.4,16.6 v36.4,15 36.4,14.8 33.6,12 33.4,12 26.8,12 v25.8,13
  Bottom 0.406: U$2.4 41.33,37.08 37.8,40.6 24.6,40.6 21,37 21,22.2 21.6,21.6 23,21.6 v23.6,22.2 | IC2.11 23.61,9.8 25.8,12 v25.8,13 | JP1.5 36,7 37.2,8.2 37.2,13.8 36.4,14.6 v36.4,15
VCC  (via drill 0.3)
  Top 0.61: v24.2,16.8 v31.2,16.8
  Bottom 0.406: U$2.26 40.67,28.93 40.6,29 | U$2.28 39.38,28.77 39.4,28.8 | IC2.10 23.48,11.07 | 33.2,18.8 33.2,18.88 C3.1
  Bottom 0.61: 40.6,29 39.6,29 39.4,28.8 39.2,28.6 39.2,23.6 38.2,22.6 38.2,20.8 36.8,19.4 33.4,19.4 33.06,19.06 | IC2.10 21.12,11.07 20.4,11.8 | 20.4,11.8 20.4,14.4 C1.1 | 49.38,4.96 C2.1 41.26,4.86 41.13,4.83 | 23.48,11.07 24.2,11.8 v24.2,16.8 | C3.1 33.06,19.06 | 20.4,11.8 20.4,6.8 19.6,6 19.6,4.4 20.55,3.46 IC2.16 28.34,3.46 29.4,2.4 39.6,2.4 41,3.8 41,4.8 41.13,4.83 | JP1.1 41.08,4.88 41.13,4.83 | v31.2,16.8 32.4,16.8 32.75,17.15 R2.2 33.06,17.39 33.06,19.06
VPRG  (via drill 0.3)
  Top 0.406: v26.4,21.4 27.2,20.6 38,20.6 40.2,18.4 v40.2,17.2
  Bottom 0.406: U$2.6 42.62,38.17 38.6,42.2 23.8,42.2 19.4,37.8 19.4,21.4 20.8,20 25,20 v26.4,21.4 | JP1.3 38.54,7.34 39.8,8.6 39.8,12.4 40.2,12.8 v40.2,17.2
XERR  (via drill 0.3)
  Top 0.406: v35.8,18.4 37.8,18.4 38.2,18 v38.2,17.2
  Bottom 0.406: U$2.23 42.62,19.62 41.2,18.2 38.8,18.2 38.2,17.6 v38.2,17.2
  Bottom 0.61: JP1.8 33.46,16.09 | 33.46,16.09 R2.1 | v35.8,18.4 34.2,16.8 34.2,16.83 33.46,16.09
XLAT  (via drill 0.3)
  Top 0.406: v30.4,14.4 24.4,14.4 22.2,16.6 v22.2,22.6
  Bottom 0.406: v22.2,22.6 21.8,23 21.8,36.6 25,39.8 37.4,39.8 40.67,36.52 40.67,34.2 U$2.3 U$2.2 | v30.4,14.4 30.4,12 30.92,11.48 JP1.10

### Text on the board
Top: Arc_Ring | Johannes | Neumann
Bottom: Arc_Ring